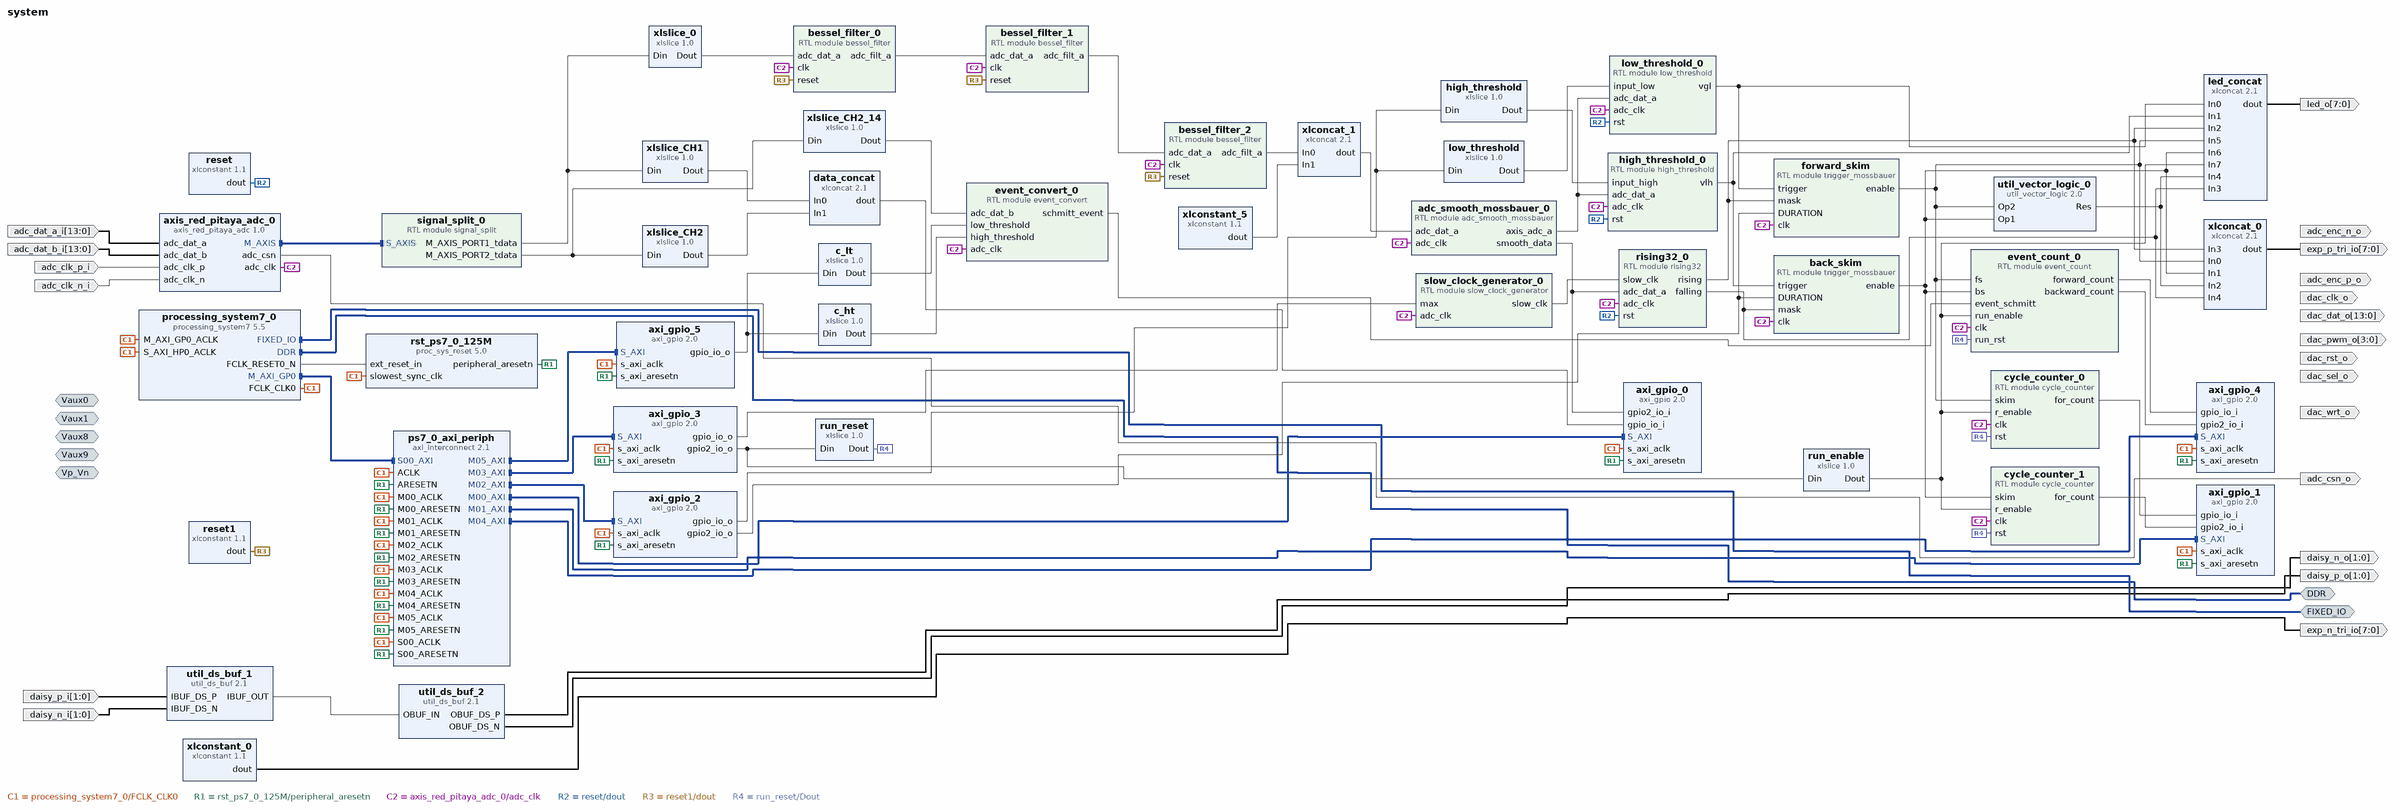
[diagram p0: block diagram of the top level]
# Vivado block design system, xc7z010clg400-1, Vivado 2020.1
create_bd_design system

create_bd_intf_port -mode Slave -vlnv xilinx.com:interface:diff_analog_io_rtl:1.0 Vp_Vn
create_bd_intf_port -mode Slave -vlnv xilinx.com:interface:diff_analog_io_rtl:1.0 Vaux0
create_bd_intf_port -mode Slave -vlnv xilinx.com:interface:diff_analog_io_rtl:1.0 Vaux1
create_bd_intf_port -mode Slave -vlnv xilinx.com:interface:diff_analog_io_rtl:1.0 Vaux9
create_bd_intf_port -mode Slave -vlnv xilinx.com:interface:diff_analog_io_rtl:1.0 Vaux8
create_bd_intf_port -mode Master -vlnv xilinx.com:interface:ddrx_rtl:1.0 DDR
create_bd_intf_port -mode Master -vlnv xilinx.com:display_processing_system7:fixedio_rtl:1.0 FIXED_IO
create_bd_port -dir I -from 13 -to 0 adc_dat_a_i
create_bd_port -dir I -from 13 -to 0 adc_dat_b_i
create_bd_port -dir I adc_clk_p_i
create_bd_port -dir I adc_clk_n_i
create_bd_port -dir O adc_enc_p_o
create_bd_port -dir O adc_enc_n_o
create_bd_port -dir O adc_csn_o
create_bd_port -dir O -from 13 -to 0 dac_dat_o
create_bd_port -dir O dac_clk_o
create_bd_port -dir O dac_rst_o
create_bd_port -dir O dac_sel_o
create_bd_port -dir O dac_wrt_o
create_bd_port -dir O -from 3 -to 0 dac_pwm_o
create_bd_port -dir O -from 7 -to 0 exp_p_tri_io
create_bd_port -dir O -from 7 -to 0 exp_n_tri_io
create_bd_port -dir O -from 1 -to 0 daisy_p_o
create_bd_port -dir O -from 1 -to 0 daisy_n_o
create_bd_port -dir I -from 1 -to 0 daisy_p_i
create_bd_port -dir I -from 1 -to 0 daisy_n_i
create_bd_port -dir O -from 7 -to 0 led_o

create_bd_cell -type ip -vlnv xilinx.com:ip:processing_system7:5.5 processing_system7_0
set_property -dict [list \
  CONFIG.PCW_APU_PERIPHERAL_FREQMHZ 666.666666 \
  CONFIG.PCW_ENET0_ENET0_IO {MIO 16 .. 27} \
  CONFIG.PCW_ENET0_GRP_MDIO_ENABLE 1 \
  CONFIG.PCW_ENET0_GRP_MDIO_IO EMIO \
  CONFIG.PCW_ENET0_PERIPHERAL_ENABLE 1 \
  CONFIG.PCW_ENET0_RESET_ENABLE 0 \
  CONFIG.PCW_ENET_RESET_ENABLE 1 \
  CONFIG.PCW_ENET_RESET_SELECT {Share reset pin} \
  CONFIG.PCW_FPGA0_PERIPHERAL_FREQMHZ 125 \
  CONFIG.PCW_FPGA1_PERIPHERAL_FREQMHZ 250 \
  CONFIG.PCW_FPGA3_PERIPHERAL_FREQMHZ 200 \
  CONFIG.PCW_GPIO_MIO_GPIO_ENABLE 1 \
  CONFIG.PCW_GPIO_MIO_GPIO_IO MIO \
  CONFIG.PCW_GPIO_PERIPHERAL_ENABLE 1 \
  CONFIG.PCW_I2C0_GRP_INT_ENABLE 0 \
  CONFIG.PCW_I2C0_I2C0_IO {MIO 50 .. 51} \
  CONFIG.PCW_I2C0_PERIPHERAL_ENABLE 1 \
  CONFIG.PCW_I2C_PERIPHERAL_FREQMHZ 111.111115 \
  CONFIG.PCW_I2C_RESET_ENABLE 1 \
  CONFIG.PCW_I2C_RESET_SELECT {Share reset pin} \
  CONFIG.PCW_IMPORT_BOARD_PRESET cfg/red_pitaya.xml \
  CONFIG.PCW_PRESET_BANK1_VOLTAGE {LVCMOS 2.5V} \
  CONFIG.PCW_QSPI_GRP_SINGLE_SS_ENABLE 1 \
  CONFIG.PCW_QSPI_GRP_SINGLE_SS_IO {MIO 1 .. 6} \
  CONFIG.PCW_QSPI_PERIPHERAL_ENABLE 1 \
  CONFIG.PCW_QSPI_PERIPHERAL_FREQMHZ 125 \
  CONFIG.PCW_QSPI_QSPI_IO {MIO 1 .. 6} \
  CONFIG.PCW_SD0_GRP_CD_ENABLE 1 \
  CONFIG.PCW_SD0_GRP_CD_IO {MIO 46} \
  CONFIG.PCW_SD0_GRP_WP_ENABLE 1 \
  CONFIG.PCW_SD0_GRP_WP_IO {MIO 47} \
  CONFIG.PCW_SD0_PERIPHERAL_ENABLE 1 \
  CONFIG.PCW_SD0_SD0_IO {MIO 40 .. 45} \
  CONFIG.PCW_SDIO_PERIPHERAL_FREQMHZ 100 \
  CONFIG.PCW_SINGLE_QSPI_DATA_MODE x4 \
  CONFIG.PCW_SPI0_PERIPHERAL_ENABLE 1 \
  CONFIG.PCW_SPI0_SPI0_IO EMIO \
  CONFIG.PCW_SPI1_PERIPHERAL_ENABLE 1 \
  CONFIG.PCW_SPI1_SPI1_IO {MIO 10 .. 15} \
  CONFIG.PCW_TTC0_PERIPHERAL_ENABLE 1 \
  CONFIG.PCW_TTC0_TTC0_IO EMIO \
  CONFIG.PCW_UART0_PERIPHERAL_ENABLE 1 \
  CONFIG.PCW_UART0_UART0_IO {MIO 14 .. 15} \
  CONFIG.PCW_UART1_PERIPHERAL_ENABLE 1 \
  CONFIG.PCW_UART1_UART1_IO {MIO 8 .. 9} \
  CONFIG.PCW_UART_PERIPHERAL_FREQMHZ 100 \
  CONFIG.PCW_UIPARAM_DDR_BUS_WIDTH {16 Bit} \
  CONFIG.PCW_UIPARAM_DDR_FREQ_MHZ 533.333333 \
  CONFIG.PCW_UIPARAM_DDR_PARTNO {MT41J256M16 RE-125} \
  CONFIG.PCW_USB0_PERIPHERAL_ENABLE 1 \
  CONFIG.PCW_USB0_RESET_ENABLE 1 \
  CONFIG.PCW_USB0_RESET_IO {MIO 48} \
  CONFIG.PCW_USB0_USB0_IO {MIO 28 .. 39} \
  CONFIG.PCW_USB_RESET_ENABLE 1 \
  CONFIG.PCW_USB_RESET_SELECT {Share reset pin} \
  CONFIG.PCW_USE_S_AXI_HP0 1 \
] [get_bd_cells processing_system7_0]
# 429 more settings of processing_system7_0 are not shown: defaults, MIO pin electricals, DDR timing, and values the tool derives
create_bd_cell -type ip -vlnv xilinx.com:ip:axi_interconnect:2.1 ps7_0_axi_periph
set_property -dict {CONFIG.NUM_MI 6} [get_bd_cells ps7_0_axi_periph]
create_bd_cell -type ip -vlnv xilinx.com:ip:proc_sys_reset:5.0 rst_ps7_0_125M
create_bd_cell -type ip -vlnv xilinx.com:ip:axi_gpio:2.0 axi_gpio_0
set_property -dict {CONFIG.C_ALL_INPUTS 1 CONFIG.C_ALL_INPUTS_2 1 CONFIG.C_IS_DUAL 1} [get_bd_cells axi_gpio_0]
create_bd_cell -type ip -vlnv xilinx.com:ip:axi_gpio:2.0 axi_gpio_1
set_property -dict {CONFIG.C_ALL_INPUTS 1 CONFIG.C_ALL_INPUTS_2 1 CONFIG.C_IS_DUAL 1} [get_bd_cells axi_gpio_1]
create_bd_cell -type ip -vlnv xilinx.com:ip:axi_gpio:2.0 axi_gpio_2
set_property -dict [list \
  CONFIG.C_ALL_OUTPUTS 1 \
  CONFIG.C_ALL_OUTPUTS_2 1 \
  CONFIG.C_DOUT_DEFAULT 0x02400120 \
  CONFIG.C_DOUT_DEFAULT_2 0x12a05f20 \
  CONFIG.C_IS_DUAL 1 \
] [get_bd_cells axi_gpio_2]
create_bd_cell -type ip -vlnv xilinx.com:ip:axi_gpio:2.0 axi_gpio_3
set_property -dict [list \
  CONFIG.C_ALL_OUTPUTS 1 \
  CONFIG.C_ALL_OUTPUTS_2 1 \
  CONFIG.C_DOUT_DEFAULT 0x00200000 \
  CONFIG.C_DOUT_DEFAULT_2 0x00000000 \
  CONFIG.C_IS_DUAL 1 \
] [get_bd_cells axi_gpio_3]
create_bd_cell -type ip -vlnv xilinx.com:ip:axi_gpio:2.0 axi_gpio_4
set_property -dict {CONFIG.C_ALL_INPUTS 1 CONFIG.C_ALL_INPUTS_2 1 CONFIG.C_IS_DUAL 1} [get_bd_cells axi_gpio_4]
create_bd_cell -type ip -vlnv xilinx.com:ip:axi_gpio:2.0 axi_gpio_5
set_property -dict [list \
  CONFIG.C_ALL_INPUTS 0 \
  CONFIG.C_ALL_OUTPUTS 1 \
  CONFIG.C_ALL_OUTPUTS_2 1 \
  CONFIG.C_DOUT_DEFAULT 0x02000100 \
  CONFIG.C_DOUT_DEFAULT_2 0x00000437 \
  CONFIG.C_IS_DUAL 1 \
] [get_bd_cells axi_gpio_5]
create_bd_cell -type ip -vlnv xilinx.com:ip:util_ds_buf:2.1 util_ds_buf_1
set_property -dict {CONFIG.C_SIZE 2} [get_bd_cells util_ds_buf_1]
create_bd_cell -type ip -vlnv xilinx.com:ip:util_ds_buf:2.1 util_ds_buf_2
set_property -dict {CONFIG.C_BUF_TYPE OBUFDS CONFIG.C_SIZE 2} [get_bd_cells util_ds_buf_2]
create_bd_cell -type ip -vlnv pavel-demin:user:axis_red_pitaya_adc:1.0 axis_red_pitaya_adc_0
create_bd_cell -type module -reference signal_split signal_split_0
create_bd_cell -type module -reference slow_clock_generator slow_clock_generator_0
create_bd_cell -type ip -vlnv xilinx.com:ip:xlconstant:1.1 reset
create_bd_cell -type ip -vlnv xilinx.com:ip:xlslice:1.0 xlslice_CH1
set_property -dict {CONFIG.DIN_FROM 15 CONFIG.DOUT_WIDTH 16} [get_bd_cells xlslice_CH1]
create_bd_cell -type ip -vlnv xilinx.com:ip:xlconcat:2.1 data_concat
set_property -dict {CONFIG.IN0_WIDTH 16 CONFIG.IN1_WIDTH 16} [get_bd_cells data_concat]
create_bd_cell -type ip -vlnv xilinx.com:ip:xlslice:1.0 low_threshold
set_property -dict {CONFIG.DIN_FROM 13 CONFIG.DOUT_WIDTH 14} [get_bd_cells low_threshold]
create_bd_cell -type ip -vlnv xilinx.com:ip:xlslice:1.0 high_threshold
set_property -dict {CONFIG.DIN_FROM 29 CONFIG.DIN_TO 16 CONFIG.DOUT_WIDTH 14} [get_bd_cells high_threshold]
create_bd_cell -type ip -vlnv xilinx.com:ip:xlconcat:2.1 led_concat
set_property -dict {CONFIG.NUM_PORTS 8} [get_bd_cells led_concat]
create_bd_cell -type ip -vlnv xilinx.com:ip:xlconstant:1.1 xlconstant_0
set_property -dict {CONFIG.CONST_VAL 0 CONFIG.CONST_WIDTH 8} [get_bd_cells xlconstant_0]
create_bd_cell -type ip -vlnv xilinx.com:ip:xlconcat:2.1 xlconcat_0
set_property -dict {CONFIG.NUM_PORTS 8} [get_bd_cells xlconcat_0]
create_bd_cell -type ip -vlnv xilinx.com:ip:xlslice:1.0 xlslice_0
set_property -dict {CONFIG.DIN_FROM 13 CONFIG.DOUT_WIDTH 14} [get_bd_cells xlslice_0]
create_bd_cell -type ip -vlnv xilinx.com:ip:xlconstant:1.1 xlconstant_5
set_property -dict {CONFIG.CONST_VAL 0 CONFIG.CONST_WIDTH 18} [get_bd_cells xlconstant_5]
create_bd_cell -type ip -vlnv xilinx.com:ip:xlconcat:2.1 xlconcat_1
set_property -dict {CONFIG.IN0_WIDTH 14 CONFIG.IN1_WIDTH 18} [get_bd_cells xlconcat_1]
create_bd_cell -type ip -vlnv xilinx.com:ip:xlconstant:1.1 reset1
create_bd_cell -type ip -vlnv xilinx.com:ip:xlslice:1.0 run_reset
create_bd_cell -type ip -vlnv xilinx.com:ip:xlslice:1.0 run_enable
set_property -dict {CONFIG.DIN_FROM 1 CONFIG.DIN_TO 1 CONFIG.DOUT_WIDTH 1} [get_bd_cells run_enable]
create_bd_cell -type module -reference cycle_counter cycle_counter_0
create_bd_cell -type module -reference cycle_counter cycle_counter_1
create_bd_cell -type ip -vlnv xilinx.com:ip:xlslice:1.0 xlslice_CH2
set_property -dict {CONFIG.DIN_FROM 15 CONFIG.DOUT_WIDTH 16} [get_bd_cells xlslice_CH2]
create_bd_cell -type ip -vlnv xilinx.com:ip:xlslice:1.0 xlslice_CH2_14
set_property -dict {CONFIG.DIN_FROM 13 CONFIG.DOUT_WIDTH 14} [get_bd_cells xlslice_CH2_14]
create_bd_cell -type ip -vlnv xilinx.com:ip:xlslice:1.0 c_ht
set_property -dict {CONFIG.DIN_FROM 29 CONFIG.DIN_TO 16 CONFIG.DOUT_WIDTH 14} [get_bd_cells c_ht]
create_bd_cell -type ip -vlnv xilinx.com:ip:xlslice:1.0 c_lt
set_property -dict {CONFIG.DIN_FROM 13 CONFIG.DIN_TO 0 CONFIG.DOUT_WIDTH 14} [get_bd_cells c_lt]
create_bd_cell -type ip -vlnv xilinx.com:ip:util_vector_logic:2.0 util_vector_logic_0
set_property -dict {CONFIG.C_OPERATION or CONFIG.C_SIZE 1} [get_bd_cells util_vector_logic_0]
create_bd_cell -type module -reference event_convert event_convert_0
create_bd_cell -type module -reference event_count event_count_0
create_bd_cell -type module -reference trigger_mossbauer forward_skim
create_bd_cell -type module -reference trigger_mossbauer back_skim
create_bd_cell -type module -reference adc_smooth_mossbauer adc_smooth_mossbauer_0
create_bd_cell -type module -reference bessel_filter bessel_filter_0
create_bd_cell -type module -reference bessel_filter bessel_filter_1
create_bd_cell -type module -reference bessel_filter bessel_filter_2
create_bd_cell -type module -reference low_threshold low_threshold_0
create_bd_cell -type module -reference rising32 rising32_0
create_bd_cell -type module -reference high_threshold high_threshold_0

# ---- connections ----

connect_bd_intf_net [get_bd_intf_ports FIXED_IO] [get_bd_intf_pins processing_system7_0/FIXED_IO]
connect_bd_intf_net [get_bd_intf_pins ps7_0_axi_periph/M00_AXI] [get_bd_intf_pins axi_gpio_0/S_AXI]
connect_bd_intf_net [get_bd_intf_pins ps7_0_axi_periph/M01_AXI] [get_bd_intf_pins axi_gpio_1/S_AXI]
connect_bd_intf_net [get_bd_intf_pins ps7_0_axi_periph/M04_AXI] [get_bd_intf_pins axi_gpio_4/S_AXI]
connect_bd_intf_net [get_bd_intf_pins ps7_0_axi_periph/M05_AXI] [get_bd_intf_pins axi_gpio_5/S_AXI]
connect_bd_intf_net [get_bd_intf_pins ps7_0_axi_periph/M02_AXI] [get_bd_intf_pins axi_gpio_2/S_AXI]
connect_bd_intf_net [get_bd_intf_pins ps7_0_axi_periph/S00_AXI] [get_bd_intf_pins processing_system7_0/M_AXI_GP0]
connect_bd_intf_net [get_bd_intf_pins signal_split_0/S_AXIS] [get_bd_intf_pins axis_red_pitaya_adc_0/M_AXIS]
connect_bd_intf_net [get_bd_intf_pins ps7_0_axi_periph/M03_AXI] [get_bd_intf_pins axi_gpio_3/S_AXI]
connect_bd_intf_net [get_bd_intf_ports DDR] [get_bd_intf_pins processing_system7_0/DDR]
connect_bd_net [get_bd_pins processing_system7_0/FCLK_CLK0] \
  [get_bd_pins processing_system7_0/M_AXI_GP0_ACLK] [get_bd_pins processing_system7_0/S_AXI_HP0_ACLK] \
  [get_bd_pins ps7_0_axi_periph/ACLK] [get_bd_pins ps7_0_axi_periph/S00_ACLK] [get_bd_pins ps7_0_axi_periph/M00_ACLK] \
  [get_bd_pins ps7_0_axi_periph/M01_ACLK] [get_bd_pins ps7_0_axi_periph/M02_ACLK] [get_bd_pins ps7_0_axi_periph/M03_ACLK] \
  [get_bd_pins ps7_0_axi_periph/M04_ACLK] [get_bd_pins ps7_0_axi_periph/M05_ACLK] \
  [get_bd_pins rst_ps7_0_125M/slowest_sync_clk] [get_bd_pins axi_gpio_0/s_axi_aclk] [get_bd_pins axi_gpio_1/s_axi_aclk] \
  [get_bd_pins axi_gpio_2/s_axi_aclk] [get_bd_pins axi_gpio_3/s_axi_aclk] [get_bd_pins axi_gpio_4/s_axi_aclk] \
  [get_bd_pins axi_gpio_5/s_axi_aclk]
connect_bd_net [get_bd_pins processing_system7_0/FCLK_RESET0_N] [get_bd_pins rst_ps7_0_125M/ext_reset_in]
connect_bd_net -net ARESETN_1 [get_bd_pins rst_ps7_0_125M/peripheral_aresetn] \
  [get_bd_pins ps7_0_axi_periph/ARESETN] [get_bd_pins ps7_0_axi_periph/S00_ARESETN] \
  [get_bd_pins ps7_0_axi_periph/M00_ARESETN] [get_bd_pins ps7_0_axi_periph/M01_ARESETN] \
  [get_bd_pins ps7_0_axi_periph/M02_ARESETN] [get_bd_pins ps7_0_axi_periph/M03_ARESETN] \
  [get_bd_pins ps7_0_axi_periph/M04_ARESETN] [get_bd_pins ps7_0_axi_periph/M05_ARESETN] \
  [get_bd_pins axi_gpio_0/s_axi_aresetn] [get_bd_pins axi_gpio_1/s_axi_aresetn] [get_bd_pins axi_gpio_2/s_axi_aresetn] \
  [get_bd_pins axi_gpio_3/s_axi_aresetn] [get_bd_pins axi_gpio_4/s_axi_aresetn] [get_bd_pins axi_gpio_5/s_axi_aresetn]
connect_bd_net [get_bd_ports daisy_p_i] [get_bd_pins util_ds_buf_1/IBUF_DS_P]
connect_bd_net [get_bd_ports daisy_n_i] [get_bd_pins util_ds_buf_1/IBUF_DS_N]
connect_bd_net [get_bd_pins util_ds_buf_2/OBUF_DS_P] [get_bd_ports daisy_p_o]
connect_bd_net [get_bd_pins util_ds_buf_2/OBUF_DS_N] [get_bd_ports daisy_n_o]
connect_bd_net [get_bd_pins util_ds_buf_1/IBUF_OUT] [get_bd_pins util_ds_buf_2/OBUF_IN]
connect_bd_net [get_bd_ports adc_dat_a_i] [get_bd_pins axis_red_pitaya_adc_0/adc_dat_a]
connect_bd_net [get_bd_ports adc_dat_b_i] [get_bd_pins axis_red_pitaya_adc_0/adc_dat_b]
connect_bd_net [get_bd_ports adc_clk_p_i] [get_bd_pins axis_red_pitaya_adc_0/adc_clk_p]
connect_bd_net [get_bd_ports adc_clk_n_i] [get_bd_pins axis_red_pitaya_adc_0/adc_clk_n]
connect_bd_net [get_bd_pins axis_red_pitaya_adc_0/adc_csn] [get_bd_ports adc_csn_o]
connect_bd_net [get_bd_pins signal_split_0/M_AXIS_PORT1_tdata] [get_bd_pins xlslice_CH1/Din] [get_bd_pins xlslice_0/Din]
connect_bd_net [get_bd_pins axis_red_pitaya_adc_0/adc_clk] \
  [get_bd_pins slow_clock_generator_0/adc_clk] [get_bd_pins cycle_counter_0/clk] [get_bd_pins cycle_counter_1/clk] \
  [get_bd_pins event_convert_0/adc_clk] [get_bd_pins event_count_0/clk] [get_bd_pins forward_skim/clk] \
  [get_bd_pins back_skim/clk] [get_bd_pins adc_smooth_mossbauer_0/adc_clk] [get_bd_pins bessel_filter_0/clk] \
  [get_bd_pins bessel_filter_1/clk] [get_bd_pins bessel_filter_2/clk] [get_bd_pins low_threshold_0/adc_clk] \
  [get_bd_pins rising32_0/adc_clk] [get_bd_pins high_threshold_0/adc_clk]
connect_bd_net [get_bd_pins adc_smooth_mossbauer_0/smooth_data] [get_bd_pins axi_gpio_0/gpio2_io_i] [get_bd_pins rising32_0/adc_dat_a]
connect_bd_net [get_bd_pins axi_gpio_3/gpio_io_o] [get_bd_pins slow_clock_generator_0/max]
connect_bd_net [get_bd_pins xlslice_CH1/Dout] [get_bd_pins data_concat/In0]
connect_bd_net [get_bd_pins data_concat/dout] [get_bd_pins axi_gpio_0/gpio_io_i]
connect_bd_net [get_bd_pins axi_gpio_2/gpio_io_o] [get_bd_pins low_threshold/Din] [get_bd_pins high_threshold/Din]
connect_bd_net [get_bd_pins reset/dout] [get_bd_pins low_threshold_0/rst] [get_bd_pins rising32_0/rst] [get_bd_pins high_threshold_0/rst]
connect_bd_net [get_bd_pins slow_clock_generator_0/slow_clk] [get_bd_pins rising32_0/slow_clk]
connect_bd_net [get_bd_pins low_threshold_0/vgl] [get_bd_pins led_concat/In0] [get_bd_pins forward_skim/trigger]
connect_bd_net [get_bd_pins rising32_0/rising] [get_bd_pins led_concat/In2] [get_bd_pins xlconcat_0/In3] [get_bd_pins forward_skim/mask]
connect_bd_net -net axi_gpio_4_gpio_io_o [get_bd_pins axi_gpio_2/gpio2_io_o] [get_bd_pins forward_skim/DURATION] [get_bd_pins back_skim/DURATION]
connect_bd_net [get_bd_pins high_threshold_0/vlh] [get_bd_pins led_concat/In1] [get_bd_pins back_skim/trigger]
connect_bd_net [get_bd_pins rising32_0/falling] [get_bd_pins led_concat/In3] [get_bd_pins xlconcat_0/In4] [get_bd_pins back_skim/mask]
connect_bd_net [get_bd_pins led_concat/dout] [get_bd_ports led_o]
connect_bd_net [get_bd_pins xlconstant_0/dout] [get_bd_ports exp_n_tri_io]
connect_bd_net [get_bd_pins forward_skim/enable] \
  [get_bd_pins xlconcat_0/In0] [get_bd_pins led_concat/In5] [get_bd_pins cycle_counter_0/skim] \
  [get_bd_pins util_vector_logic_0/Op2] [get_bd_pins event_count_0/fs]
connect_bd_net [get_bd_pins back_skim/enable] \
  [get_bd_pins xlconcat_0/In1] [get_bd_pins led_concat/In6] [get_bd_pins cycle_counter_1/skim] \
  [get_bd_pins util_vector_logic_0/Op1] [get_bd_pins event_count_0/bs]
connect_bd_net [get_bd_pins xlconcat_0/dout] [get_bd_ports exp_p_tri_io]
connect_bd_net [get_bd_pins xlconstant_5/dout] [get_bd_pins xlconcat_1/In1]
connect_bd_net [get_bd_pins xlconcat_1/dout] [get_bd_pins adc_smooth_mossbauer_0/adc_dat_a]
connect_bd_net [get_bd_pins xlslice_0/Dout] [get_bd_pins bessel_filter_0/adc_dat_a]
connect_bd_net [get_bd_pins bessel_filter_0/adc_filt_a] [get_bd_pins bessel_filter_1/adc_dat_a]
connect_bd_net [get_bd_pins reset1/dout] [get_bd_pins bessel_filter_0/reset] [get_bd_pins bessel_filter_1/reset] [get_bd_pins bessel_filter_2/reset]
connect_bd_net [get_bd_pins cycle_counter_0/for_count] [get_bd_pins axi_gpio_1/gpio_io_i]
connect_bd_net [get_bd_pins cycle_counter_1/for_count] [get_bd_pins axi_gpio_1/gpio2_io_i]
connect_bd_net [get_bd_pins axi_gpio_3/gpio2_io_o] [get_bd_pins run_reset/Din] [get_bd_pins run_enable/Din]
connect_bd_net [get_bd_pins run_reset/Dout] [get_bd_pins cycle_counter_0/rst] [get_bd_pins cycle_counter_1/rst] [get_bd_pins event_count_0/run_rst]
connect_bd_net [get_bd_pins run_enable/Dout] \
  [get_bd_pins cycle_counter_0/r_enable] [get_bd_pins cycle_counter_1/r_enable] [get_bd_pins event_count_0/run_enable] \
  [get_bd_pins led_concat/In7]
connect_bd_net [get_bd_pins xlslice_CH2/Dout] [get_bd_pins data_concat/In1]
connect_bd_net [get_bd_pins signal_split_0/M_AXIS_PORT2_tdata] [get_bd_pins xlslice_CH2/Din] [get_bd_pins xlslice_CH2_14/Din]
connect_bd_net [get_bd_pins xlslice_CH2_14/Dout] [get_bd_pins event_convert_0/adc_dat_b]
connect_bd_net [get_bd_pins axi_gpio_5/gpio_io_o] [get_bd_pins c_ht/Din] [get_bd_pins c_lt/Din]
connect_bd_net [get_bd_pins c_ht/Dout] [get_bd_pins event_convert_0/high_threshold]
connect_bd_net -net l_ht_Dout [get_bd_pins c_lt/Dout] [get_bd_pins event_convert_0/low_threshold]
connect_bd_net [get_bd_pins event_convert_0/schmitt_event] [get_bd_pins event_count_0/event_schmitt]
connect_bd_net [get_bd_pins event_count_0/forward_count] [get_bd_pins axi_gpio_4/gpio_io_i]
connect_bd_net [get_bd_pins event_count_0/backward_count] [get_bd_pins axi_gpio_4/gpio2_io_i]
connect_bd_net [get_bd_pins util_vector_logic_0/Res] [get_bd_pins xlconcat_0/In2] [get_bd_pins led_concat/In4]
connect_bd_net [get_bd_pins low_threshold/Dout] [get_bd_pins low_threshold_0/input_low]
connect_bd_net [get_bd_pins high_threshold/Dout] [get_bd_pins high_threshold_0/input_high]
connect_bd_net [get_bd_pins adc_smooth_mossbauer_0/axis_adc_a] [get_bd_pins low_threshold_0/adc_dat_a] [get_bd_pins high_threshold_0/adc_dat_a]
connect_bd_net [get_bd_pins bessel_filter_1/adc_filt_a] [get_bd_pins bessel_filter_2/adc_dat_a]
connect_bd_net [get_bd_pins bessel_filter_2/adc_filt_a] [get_bd_pins xlconcat_1/In0]

# ---- address map ----
assign_bd_address -offset 0x42000000 -range 1K -target_address_space [get_bd_addr_spaces processing_system7_0/Data] [get_bd_addr_segs axi_gpio_0/S_AXI/Reg]
assign_bd_address -offset 0x42100000 -range 1K -target_address_space [get_bd_addr_spaces processing_system7_0/Data] [get_bd_addr_segs axi_gpio_1/S_AXI/Reg]
assign_bd_address -offset 0x42200000 -range 1K -target_address_space [get_bd_addr_spaces processing_system7_0/Data] [get_bd_addr_segs axi_gpio_2/S_AXI/Reg]
assign_bd_address -offset 0x42300000 -range 1K -target_address_space [get_bd_addr_spaces processing_system7_0/Data] [get_bd_addr_segs axi_gpio_3/S_AXI/Reg]
assign_bd_address -offset 0x42400000 -range 1K -target_address_space [get_bd_addr_spaces processing_system7_0/Data] [get_bd_addr_segs axi_gpio_4/S_AXI/Reg]
assign_bd_address -offset 0x42500000 -range 1K -target_address_space [get_bd_addr_spaces processing_system7_0/Data] [get_bd_addr_segs axi_gpio_5/S_AXI/Reg]

validate_bd_design
save_bd_design
